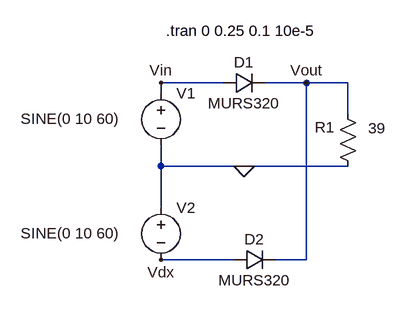
[diagram p0: schematic questao2_onda_completa.asc]
questao2_onda_completa.asc, the LTspice schematic file:
Version 4
SHEET 1 880 680
WIRE 96 -96 0 -96
WIRE 224 -96 160 -96
WIRE 288 -96 224 -96
WIRE 0 -80 0 -96
WIRE 288 -48 288 -96
WIRE 0 32 0 0
WIRE 128 32 0 32
WIRE 288 32 128 32
WIRE 0 96 0 32
WIRE 112 176 0 176
WIRE 224 176 224 -96
WIRE 224 176 176 176
FLAG 224 -96 Vout
FLAG 0 -96 Vin
FLAG 128 32 0
FLAG 0 176 Vdx
SYMBOL diode 96 -80 R270
WINDOW 0 32 32 VTop 2
WINDOW 3 0 32 VBottom 2
SYMATTR InstName D1
SYMATTR Value MURS320
SYMBOL res 304 48 R180
WINDOW 0 36 76 Left 2
WINDOW 3 -42 74 Left 2
SYMATTR InstName R1
SYMATTR Value 39
SYMBOL voltage 0 -96 R0
WINDOW 123 0 0 Left 0
WINDOW 39 0 0 Left 0
WINDOW 3 -216 55 Left 2
SYMATTR Value SINE(0 10 60)
SYMATTR InstName V1
SYMBOL voltage 0 80 R0
WINDOW 123 0 0 Left 0
WINDOW 39 0 0 Left 0
WINDOW 3 -216 55 Left 2
SYMATTR Value SINE(0 10 60)
SYMATTR InstName V2
SYMBOL diode 112 192 R270
WINDOW 0 32 32 VTop 2
WINDOW 3 0 32 VBottom 2
SYMATTR InstName D2
SYMATTR Value MURS320
TEXT 8 -176 Left 2 !.tran 0 0.25 0.1 10e-5

The netlist it stands for:
* questao2_onda_completa.asc
D1 Vin Vout MURS320
R1 0 Vout 39
V1 Vin 0 SINE(0 10 60)
V2 0 Vdx SINE(0 10 60)
D2 Vdx Vout MURS320
.model D D
.lib standard.dio
.tran 0 0.25 0.1 10e-5
.backanno
.end